# EasyEDA Pro project GController.eprj, schematic GController, sheet 4 of 4

## Sheets
4 Touchscreen-PowerSupply: Create Date: 2024-08-28; Page Name: Touchscreen-PowerSupply; Update Date: 2024-08-28; Part Number: JLCPCB-002
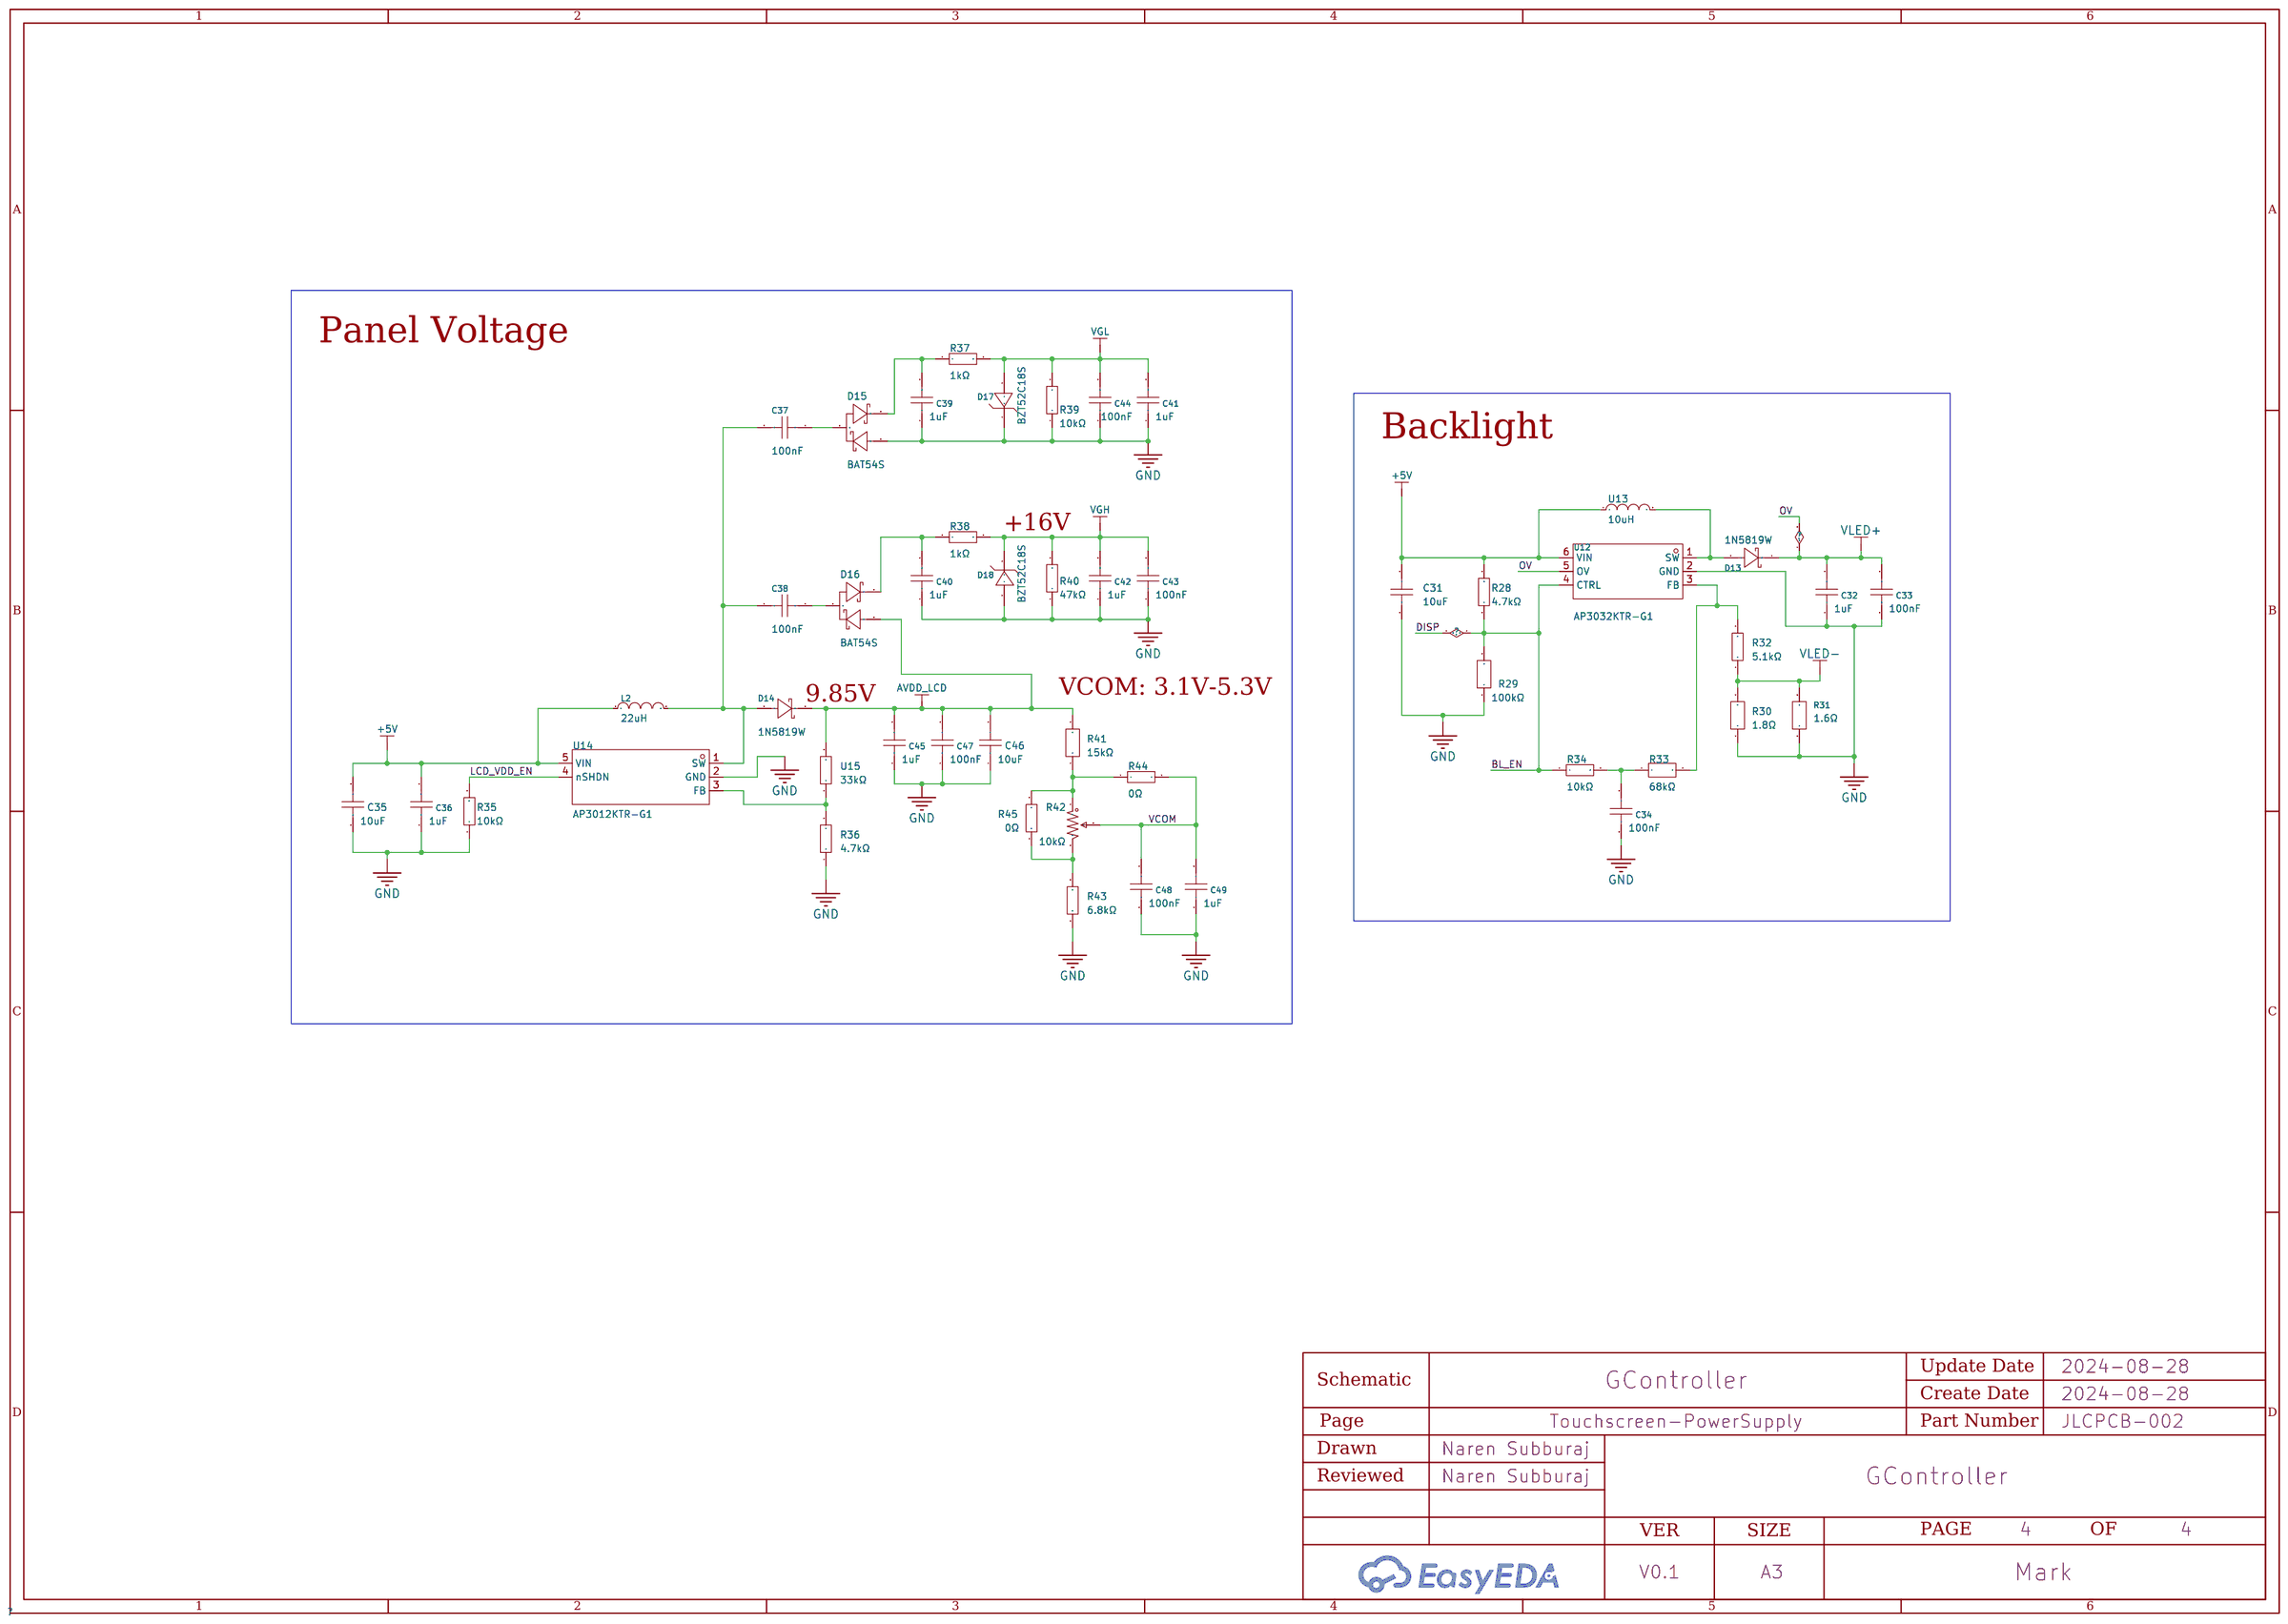
[diagram p3: Touchscreen-PowerSupply]

## Parts
C31  10uF  [C0805]
C32  1uF  [C0603]
C33  100nF  [C0603]
C34  100nF  [C0603]
C35  10uF  [C0805]
C36  1uF  [C0603]
C37  100nF  [C0603]
C38  100nF  [C0603]
C39  1uF  [C0603]
C40  1uF  [C0603]
C41  1uF  [C0603]
C42  1uF  [C0603]
C43  100nF  [C0603]
C44  100nF  [C0603]
C45  1uF  [C0603]
C46  10uF  [C0805]
C47  100nF  [C0603]
C48  100nF  [C0603]
C49  1uF  [C0603]
D13  1N5819W  [SOD-123_L2.8-W1.8-LS3.7-RD]
D14  1N5819W  [SOD-123_L2.8-W1.8-LS3.7-RD]
D15  BAT54S  [SOT-23-3_L2.9-W1.3-P1.90-LS2.4-BR]
D16  BAT54S  [SOT-23-3_L2.9-W1.3-P1.90-LS2.4-BR]
D17  BZT52C18S  [SOD-323_L1.8-W1.3-LS2.5-RD]
D18  BZT52C18S  [SOD-323_L1.8-W1.3-LS2.5-RD]
L2  22uH  [IND-SMD_L4.9-W4.9_NRS50XX]
R28  4.7kΩ  [R0603]
R29  100kΩ  [R0603]
R30  1.8Ω  [R0805]
R31  1.6Ω  [R0805]
R32  5.1kΩ  [R0603]
R33  68kΩ  [R0603]
R34  10kΩ  [R0603]
R35  10kΩ  [R0603]
R36  4.7kΩ  [R0603]
R37  1kΩ  [R0603]
R38  1kΩ  [R0603]
R39  10kΩ  [R0603]
R40  47kΩ  [R0603]
R41  15kΩ  [R0603]
R42  10kΩ  [RES-ADJ-SMD_RM065-V1]
R43  6.8kΩ  [R0603]
R44  0Ω  [R0603]
R45  0Ω  [R0603]
U12  AP3032KTR-G1  [SOT-23-6_L2.9-W1.6-P0.95-LS2.8-BR]
U13  10uH  [IND-SMD_L4.4-W4.2_BCIHP0412SC]
U14  AP3012KTR-G1  [TSOT-23-5_L2.9-W1.6-P0.95-LS2.8-BL]
U15  33kΩ  [R0603]

## Library data of the parts
C31 C35 C46 = CL21A106KAYNNNE_C15850: Capacitance: Tolerance:±10% Tolerance:±10% Voltage Rated: Temperature Coefficient:; LCSC Part Name: 10uF ±10% 25V; Supplier Part: C15850; Manufacturer: SAMSUNG(三星); Manufacturer Part: CL21A106KAYNNNE; Supplier Footprint: 0805; JLCPCB Part Class: Basic Part; Datasheet: https://atta.szlcsc.com/upload/public/pdf/source/20160218/1457707763339.pdf; Supplier: LCSC; Tolerance: ±10%
C32 C36 C39-C42 C45 C49 = C0603X5R105K250NT: Capacitance: Tolerance:±10% Tolerance:±10% Voltage Rated: Temperature Coefficient:; LCSC Part Name: 1uF ±10% 25V; Supplier Part: C466771; Manufacturer: SANYEAR(叁叶源); Supplier Footprint: 0603; JLCPCB Part Class: Extended Part; Datasheet: https://atta.szlcsc.com/upload/public/pdf/source/20200102/C475251_1E30ECAC0E8AE7254982658A02A2D78C.pdf; Supplier: LCSC; Tolerance: ±10%
C33 C34 C37 C38 C43 C44 C47 C48 = CC0603KRX7R9BB104: Capacitance: Tolerance:±10% Tolerance:±10% Voltage Rated: Temperature Coefficient:; LCSC Part Name: 100nF ±10% 50V; Supplier Part: C14663; Manufacturer: YAGEO(国巨); Supplier Footprint: 0603; JLCPCB Part Class: Basic Part; Datasheet: https://atta.szlcsc.com/upload/public/pdf/source/20180910/C282072_33301C7F631E79921B82A8DAC6BCC5B3.pdf; Supplier: LCSC; Tolerance: ±10%
D13 D14 = 1N5819W_C727115: Diode Configuration:Single Forward Voltage (Vf@If):900mV@3A Reverse Voltage (Vr):40V Average Rectified Current (Io):1A Reverse Leakage Current (Ir):1mA@40V; LCSC Part Name: 电压:40V 电流:1A; Supplier Part: C727115; Manufacturer: TWGMC(台湾迪嘉); Supplier Footprint: SOD-123; JLCPCB Part Class: Extended Part; Datasheet: https://atta.szlcsc.com/upload/public/pdf/source/20220518/A32FD9482A1BC542ED9C09095620CB64.pdf; Supplier: LCSC; Diode Configuration: Single; Forward Voltage (Vf@If): 900mV@3A; Reverse Voltage (Vr): 40V; Average Rectified Current (Io): 1A; Reverse Leakage Current (Ir): 1mA@40V
D15 D16 = BAT54S_C916425: Diode Configuration:1对串联式 Forward Voltage (Vf@If):800mV@100mA Reverse Voltage (Vr):30V Average Rectified Current (Io):200mA Reverse Leakage Current (Ir):2uA@25V; LCSC Part Name: 电压:30V 电流:200mA; Supplier Part: C916425; Manufacturer: JSMSEMI(杰盛微); Supplier Footprint: SOT-23; JLCPCB Part Class: Extended Part; Datasheet: https://atta.szlcsc.com/upload/public/pdf/source/20230807/4DC032BFF2527F74FFA5A2420773D8A6.pdf; Supplier: LCSC; Diode Configuration: 1对串联式; Forward Voltage (Vf@If): 800mV@100mA; Reverse Voltage (Vr): 30V; Average Rectified Current (Io): 200mA; Reverse Leakage Current (Ir): 2uA@25V
D17 D18 = BZT52C18S_C173446: Diode Configuration:Single Zener Voltage (Nom):18V Reverse Leakage Current (Ir):100nA@12.6V Zener Voltage (Range):16.8V~19.1V Zener Voltage (Range):16.8V~19.1V Power Dissipation:200mW Zener Impedance (Zzt):45Ω Tolerance:- Tolerance:-; Supplier Part: C173446; Manufacturer: MDD; Supplier Footprint: SOD-323; JLCPCB Part Class: Extended Part; Datasheet: https://atta.szlcsc.com/upload/public/pdf/source/20230823/808D44843A9B65A969625980AC8C1BE8.pdf; Supplier: LCSC; Diode Configuration: Single; Zener Voltage (Nom): 18V; Reverse Leakage Current (Ir): 100nA@12.6V; Zener Voltage (Range): 16.8V~19.1V; Power Dissipation: 200mW; Zener Impedance (Zzt): 45Ω
L2 = NRS5020T220MMGJV: Inductance: Tolerance:±20% Tolerance:±20% Rated Current: Saturation Current (Isat):900mA DC Resistance (DCR): Type:- Ratings:AEC-Q200; LCSC Part Name: 22uH ±20% 900mA; Supplier Part: C515385; Manufacturer: TAIYO YUDEN(太诱); Supplier Footprint: SMD,4.9x4.9mm; JLCPCB Part Class: Extended Part; Datasheet: https://atta.szlcsc.com/upload/public/pdf/source/20190329/C222848_0E03677360B3A1898B651728462F6FFE.pdf; Supplier: LCSC; Tolerance: ±20%; Saturation Current (Isat): 900mA; Ratings: AEC-Q200
R28 = PTFR0603B4K70P9: Type:Thin Film Resistor Resistance: Tolerance:±0.1% Tolerance:±0.1% Power(Watts): Overload Voltage (Max): Temperature Coefficient:±25ppm/℃ Temperature Coefficient:±25ppm/℃ Operating Temperature Range:-55℃~+125℃ Operating Temperature Range:-55℃~+125℃; LCSC Part Name: 薄膜电阻 4.7kΩ ±0.1% 100mW; Supplier Part: C328429; Manufacturer: RESI(开步睿思); Supplier Footprint: 0603; JLCPCB Part Class: Extended Part; Datasheet: https://atta.szlcsc.com/upload/public/pdf/source/20240506/11BDC7478D84177AC2A5326A65B6EB29.pdf; Supplier: LCSC; Type: Thin Film Resistor; Tolerance: ±0.1%; Temperature Coefficient: ±25ppm/℃; Operating Temperature Range: -55℃~+125℃
R29 = CR-03JL7--100K: Type:Thick Film Resistors Resistance: Tolerance:±5% Tolerance:±5% Power(Watts): Overload Voltage (Max): Temperature Coefficient:±100ppm/℃ Temperature Coefficient:±100ppm/℃ Operating Temperature Range:-55℃~+155℃ Operating Temperature Range:-55℃~+155℃; LCSC Part Name: 厚膜电阻 100kΩ ±5% 100mW; Supplier Part: C217279; Manufacturer: Viking(光颉); Supplier Footprint: 0603; JLCPCB Part Class: Extended Part; Datasheet: https://atta.szlcsc.com/upload/public/pdf/source/20191209/C468528_6D47111E78448DF1E24F001397B2DC7E.pdf; Supplier: LCSC; Type: Thick Film Resistors; Tolerance: ±5%; Temperature Coefficient: ±100ppm/℃; Operating Temperature Range: -55℃~+155℃
R30 = RC0805FR-071R8L: Type:Thick Film Resistors Resistance: Tolerance:±1% Tolerance:±1% Power(Watts): Overload Voltage (Max): Temperature Coefficient:±200ppm/℃ Temperature Coefficient:±200ppm/℃ Operating Temperature Range:-55℃~+155℃ Operating Temperature Range:-55℃~+155℃; LCSC Part Name: 厚膜电阻 1.8Ω ±1% 125mW; Supplier Part: C482990; Manufacturer: YAGEO(国巨); Supplier Footprint: 0805; JLCPCB Part Class: Extended Part; Datasheet: https://atta.szlcsc.com/upload/public/pdf/source/20200715/C482990_9DB74A2815C602721D2BD8256D955806.pdf; Supplier: LCSC; Type: Thick Film Resistors; Tolerance: ±1%; Temperature Coefficient: ±200ppm/℃; Operating Temperature Range: -55℃~+155℃
R31 = ERJ6GEYJ1R6V: Type:Thick Film Resistors Resistance: Tolerance:±5% Tolerance:±5% Power(Watts): Overload Voltage (Max):- Temperature Coefficient:-100ppm/℃~+600ppm/℃ Temperature Coefficient:-100ppm/℃~+600ppm/℃ Operating Temperature Range:-55℃~+155℃ Operating Temperature R; LCSC Part Name: 1.6Ω ±5% 125mW 厚膜电阻; Supplier Part: C413130; Manufacturer: PANASONIC(松下); Supplier Footprint: 0805; JLCPCB Part Class: Extended Part; Datasheet: https://atta.szlcsc.com/upload/public/pdf/source/20190820/C413130_6B94FFE537049C6603AA72F284D494D0.pdf; Supplier: LCSC; Type: Thick Film Resistors; Tolerance: ±5%; Temperature Coefficient: -100ppm/℃~+600ppm/℃; Operating Temperature Range: -55℃~+155℃
R32 = WR06X512JTL: Type:Thick Film Resistors Resistance: Tolerance:±5% Tolerance:±5% Power(Watts): Overload Voltage (Max): Temperature Coefficient:±100ppm/℃ Temperature Coefficient:±100ppm/℃ Operating Temperature Range:-55℃~+155℃ Operating Temperature Range:-55℃~+155℃; LCSC Part Name: 厚膜电阻 5.1kΩ ±5% 100mW; Supplier Part: C163928; Manufacturer: Walsin(华新科); Supplier Footprint: 0603; JLCPCB Part Class: Extended Part; Datasheet: https://atta.szlcsc.com/upload/public/pdf/source/20191217/C470037_D99261402F77DA8B1D609223749D445A.pdf; Supplier: LCSC; Type: Thick Film Resistors; Tolerance: ±5%; Temperature Coefficient: ±100ppm/℃; Operating Temperature Range: -55℃~+155℃
R33 = SCR0603F68K: Type:Thick Film Resistors Resistance: Tolerance:±1% Tolerance:±1% Power(Watts): Overload Voltage (Max): Operating Temperature Range:-55℃~+155℃ Operating Temperature Range:-55℃~+155℃; LCSC Part Name: 厚膜电阻 68kΩ ±1% 100mW; Supplier Part: C3016380; Manufacturer: VO(翔胜); Supplier Footprint: 0603; JLCPCB Part Class: Extended Part; Datasheet: https://atta.szlcsc.com/upload/public/pdf/source/20220513/247AF9639BA21CF93567DC289CCC6A22.pdf; Supplier: LCSC; Type: Thick Film Resistors; Tolerance: ±1%; Operating Temperature Range: -55℃~+155℃
R34 R35 R39 = RC0603FR-0710KL: Type:Thick Film Resistors Resistance: Tolerance:±1% Tolerance:±1% Power(Watts): Overload Voltage (Max): Temperature Coefficient:±100ppm/℃ Temperature Coefficient:±100ppm/℃ Operating Temperature Range:-55℃~+155℃ Operating Temperature Range:-55℃~+155℃; LCSC Part Name: 厚膜电阻 10kΩ ±1% 100mW; Supplier Part: C98220; Manufacturer: YAGEO(国巨); Supplier Footprint: 0603; JLCPCB Part Class: Extended Part; Datasheet: https://atta.szlcsc.com/upload/public/pdf/source/20180927/C295883_E8D83085EA81BD7DE0B2B681138C15EE.pdf; Supplier: LCSC; Type: Thick Film Resistors; Tolerance: ±1%; Temperature Coefficient: ±100ppm/℃; Operating Temperature Range: -55℃~+155℃
R36 = RC0603FR-074K7L: Type:Thick Film Resistors Resistance: Tolerance:±1% Tolerance:±1% Power(Watts): Overload Voltage (Max): Temperature Coefficient:±100ppm/℃ Temperature Coefficient:±100ppm/℃ Operating Temperature Range:-55℃~+155℃ Operating Temperature Range:-55℃~+155℃; LCSC Part Name: 厚膜电阻 4.7kΩ ±1% 100mW; Supplier Part: C99782; Manufacturer: YAGEO(国巨); Supplier Footprint: 0603; JLCPCB Part Class: Extended Part; Datasheet: https://atta.szlcsc.com/upload/public/pdf/source/20180224/C181757_15194369480721363983.pdf; Supplier: LCSC; Type: Thick Film Resistors; Tolerance: ±1%; Temperature Coefficient: ±100ppm/℃; Operating Temperature Range: -55℃~+155℃
R37 R38 = RC0603FR-071KL: Type:Thick Film Resistors Resistance: Tolerance:±1% Tolerance:±1% Power(Watts): Overload Voltage (Max): Temperature Coefficient:±100ppm/℃ Temperature Coefficient:±100ppm/℃ Operating Temperature Range:-55℃~+155℃ Operating Temperature Range:-55℃~+155℃; LCSC Part Name: 厚膜电阻 1kΩ ±1% 100mW; Supplier Part: C22548; Manufacturer: YAGEO(国巨); Supplier Footprint: 0603; JLCPCB Part Class: Extended Part; Datasheet: https://atta.szlcsc.com/upload/public/pdf/source/20180316/70C0E2BDAE7FCC62C531A5A58D202EE1.pdf; Supplier: LCSC; Type: Thick Film Resistors; Tolerance: ±1%; Temperature Coefficient: ±100ppm/℃; Operating Temperature Range: -55℃~+155℃
R40 = RC0603FR-0747KL: Type:Thick Film Resistors Resistance: Tolerance:±1% Tolerance:±1% Power(Watts): Overload Voltage (Max): Temperature Coefficient:±100ppm/℃ Temperature Coefficient:±100ppm/℃ Operating Temperature Range:-55℃~+155℃ Operating Temperature Range:-55℃~+155℃; LCSC Part Name: 厚膜电阻 47kΩ ±1% 100mW; Supplier Part: C105579; Manufacturer: YAGEO(国巨); Supplier Footprint: 0603; JLCPCB Part Class: Extended Part; Datasheet: https://atta.szlcsc.com/upload/public/pdf/source/20180316/70C0E2BDAE7FCC62C531A5A58D202EE1.pdf; Supplier: LCSC; Type: Thick Film Resistors; Tolerance: ±1%; Temperature Coefficient: ±100ppm/℃; Operating Temperature Range: -55℃~+155℃
R41 = RT0603BRE0715KL: Type:Thin Film Resistor Resistance: Tolerance:±0.1% Tolerance:±0.1% Power(Watts): Overload Voltage (Max): Temperature Coefficient:±50ppm/℃ Temperature Coefficient:±50ppm/℃ Operating Temperature Range:-55℃~+155℃ Operating Temperature Range:-55℃~+155℃; LCSC Part Name: 薄膜电阻 15kΩ ±0.1% 100mW; Supplier Part: C705813; Manufacturer: YAGEO(国巨); Supplier Footprint: 0603; JLCPCB Part Class: Extended Part; Datasheet: https://atta.szlcsc.com/upload/public/pdf/source/20200720/C705813_BD3B2A443EF3CA751B5B4BA9FDAA73B2.pdf; Supplier: LCSC; Type: Thin Film Resistor; Tolerance: ±0.1%; Temperature Coefficient: ±50ppm/℃; Operating Temperature Range: -55℃~+155℃
R42 = RM065-103(10K): Resistance:10kΩ Tolerance:±25% Tolerance:±25% Power(Watts):; LCSC Part Name: 10kΩ ±25%; Supplier Part: C5205021; Manufacturer: BOCHEN(博晨); Supplier Footprint: 插件; JLCPCB Part Class: Extended Part; Datasheet: https://atta.szlcsc.com/upload/public/pdf/source/20221019/6263C46FBC7F1B66CBAADA74DC5EFAA2.pdf; Supplier: LCSC; Tolerance: ±25%
R43 = RC0603JR-076K8L: Type:Thick Film Resistors Resistance: Tolerance:±5% Tolerance:±5% Power(Watts): Overload Voltage (Max): Temperature Coefficient:±100ppm/℃ Temperature Coefficient:±100ppm/℃ Operating Temperature Range:-55℃~+155℃ Operating Temperature Range:-55℃~+155℃; LCSC Part Name: 厚膜电阻 6.8kΩ ±5% 100mW; Supplier Part: C127446; Manufacturer: YAGEO(国巨); Supplier Footprint: 0603; JLCPCB Part Class: Extended Part; Datasheet: https://atta.szlcsc.com/upload/public/pdf/source/20180821/C275644_0D56F95EFF785E7D9A1FEF436B37DA78.pdf; Supplier: LCSC; Type: Thick Film Resistors; Tolerance: ±5%; Temperature Coefficient: ±100ppm/℃; Operating Temperature Range: -55℃~+155℃
R44 R45 = MR06X000PTL: Type:Thick Film Resistors Resistance: Power(Watts): Overload Voltage (Max): Temperature Coefficient:-200ppm/℃~+400ppm/℃ Temperature Coefficient:-200ppm/℃~+400ppm/℃ Operating Temperature Range:-55℃~+155℃ Operating Temperature Range:-55℃~+155℃; LCSC Part Name: 厚膜电阻 0Ω 125mW; Supplier Part: C327824; Manufacturer: Walsin(华新科); Supplier Footprint: 0603; JLCPCB Part Class: Extended Part; Datasheet: https://atta.szlcsc.com/upload/public/pdf/source/20190927/C431928_EFD0274D1DCD4BC1E8C9515D468AAF68.pdf; Supplier: LCSC; Type: Thick Film Resistors; Temperature Coefficient: -200ppm/℃~+400ppm/℃; Operating Temperature Range: -55℃~+155℃
U12 = AP3032KTR-G1: Type:DC-DCVoltage Stabilizer Input Voltage:2.7V~9V Input Voltage:2.7V~9V Switch Frequency:1MHz Switch Frequency:1MHz Channels:1 Output Voltage:- Output Voltage:- Output Current:1.4A Dimming:PWM Features:- Topology:boost converter Operating temperature:-40; LCSC Part Name: 输出1.4A 升压型驱动; Supplier Part: C264086; Manufacturer: DIODES(美台); Supplier Footprint: SOT-23-6; JLCPCB Part Class: Extended Part; Datasheet: https://atta.szlcsc.com/upload/public/pdf/source/20180814/C264086_E65DFFCFC0D5B7749C7C40AA828BCF4C.pdf; Supplier: LCSC; Type: DC-DCVoltage Stabilizer; Input Voltage: 2.7V~9V; Switch Frequency: 1MHz; Channels: 1; Output Current: 1.4A; Dimming: PWM; Topology: boost converter; Operating temperature: -40℃~+85℃
U13 = BCIHP0420SC-100M: Inductance: Tolerance:±20% Tolerance:±20% Rated Current: Saturation Current (Isat): DC Resistance (DCR):282mΩ Q @ Freq:- Frequency - Self Resonant:-; LCSC Part Name: 10uH ±20% 2A; Supplier Part: C2921170; Manufacturer: BC(台湾诚阳); Supplier Footprint: SMD,4.2x4.4mm; JLCPCB Part Class: Extended Part; Datasheet: https://atta.szlcsc.com/upload/public/pdf/source/20220607/0F62A2B68923DD0945D5F83B99590D06.pdf; Supplier: LCSC; Tolerance: ±20%; DC Resistance (DCR): 282mΩ
U14 = AP3012KTR-G1: Function:boost converterType Output Type:Adjustable Input Voltage:2.6V~16V Input Voltage:2.6V~16V Output Voltage:1.25V~29V Output Voltage:1.25V~29V Output Current (Max):500mA Switching Frequency:1.5MHz Operating Temperature:-40℃~+85℃@(TA) Operating Temper; Supplier Part: C102618; Manufacturer: DIODES(美台); Supplier Footprint: SOT-23-5; JLCPCB Part Class: Extended Part; Datasheet: https://atta.szlcsc.com/upload/public/pdf/source/20191127/C460356_AACB9653A67EC58211AB2AB041FDC9A0.pdf; Supplier: LCSC; Function: boost converterType; Output Type: Adjustable; Input Voltage: 2.6V~16V; Output Voltage: 1.25V~29V; Output Current (Max): 500mA; Switching Frequency: 1.5MHz; Operating Temperature: -40℃~+85℃@(TA); Synchronous Rectification: NO; Number of Outputs: 1; Topology: Boost; Switch tube (built-in/external): 内置
U15 = HPCR0603F33K0K9: Type:Thick Film Resistors Resistance: Tolerance:±1% Tolerance:±1% Power(Watts): Overload Voltage (Max): Temperature Coefficient:±100ppm/℃ Temperature Coefficient:±100ppm/℃ Operating Temperature Range:-55℃~+125℃ Operating Temperature Range:-55℃~+125℃; LCSC Part Name: 厚膜电阻 33kΩ ±1% 200mW; Supplier Part: C365146; Manufacturer: RESI(开步睿思); Supplier Footprint: 0603; JLCPCB Part Class: Extended Part; Datasheet: https://atta.szlcsc.com/upload/public/pdf/source/20200302/C492020_A67DFE56E3A0098A28FA0495227278A6.pdf; Supplier: LCSC; Type: Thick Film Resistors; Tolerance: ±1%; Temperature Coefficient: ±100ppm/℃; Operating Temperature Range: -55℃~+125℃

## Nets
+5V: C31.2 C35.2 C36.2 L2.1 R28.2 U12.6(VIN) U13.1 U14.5(VIN) ; also on sheet 1 3
AVDD_LCD: C45.2 C46.2 C47.2 D14.1(C) D16.1(A) R41.2 U15.2 ; also on sheet 2
GND: C31.1 C32.1 C33.1 C34.1 C35.1 C36.1 C39.1 C40.1 C41.1 C42.1 C43.1 C44.1 C45.1 C46.1 C47.1 C48.2 C49.1 D15.1(A) D17.1(K) D18.2(A) R29.1 R30.1 R31.1 R35.1 R36.1 R39.1 R40.1 R43.1 U12.2(GND) U14.2(GND) ; also on sheet 1 2 3
BL_EN: R28.1 R29.2 R34.1 U12.4(CTRL) ; also on sheet 2
EXTIO6: R35.2 U14.4(nSHDN) ; also on sheet 2
VCOM: C48.1 C49.2 R42.2 R44.2 ; also on sheet 2
VGH: C42.2 C43.2 D18.1(K) R38.2 R40.2 ; also on sheet 2
VGL: C41.2 C44.2 D17.2(A) R37.2 R39.2 ; also on sheet 2
VLED+: C32.2 C33.2 D13.1(C) U12.5(OV) ; also on sheet 2
VLED-: R30.2 R31.2 R32.1 ; also on sheet 2
$4N1112: D13.2(A) U12.1(SW) U13.2
$4N1734: R32.2 R33.2 U12.3(FB)
$4N1750: C34.2 R33.1 R34.2
$4N2833: R36.2 U14.3(FB) U15.1
$4N3067: C38.1 D16.3
$4N3070: C37.1 D15.3
$4N3628: C37.2 C38.2 D14.2(A) L2.2 U14.1(SW)
$4N3650: C39.2 D15.2(K) R37.1
$4N3848: C40.2 D16.2(K) R38.1
$4N4619: R41.1 R42.1 R44.1 R45.2
$4N4642: R42.3 R43.2 R45.1

## Notes on the sheets
sheet 4
- Panel Voltage
- Backlight
- +16V
- 9.85V
- VCOM: 3.1V-5.3V
